# EAGLE design Upper_Board (EAGLE 7.2.0)
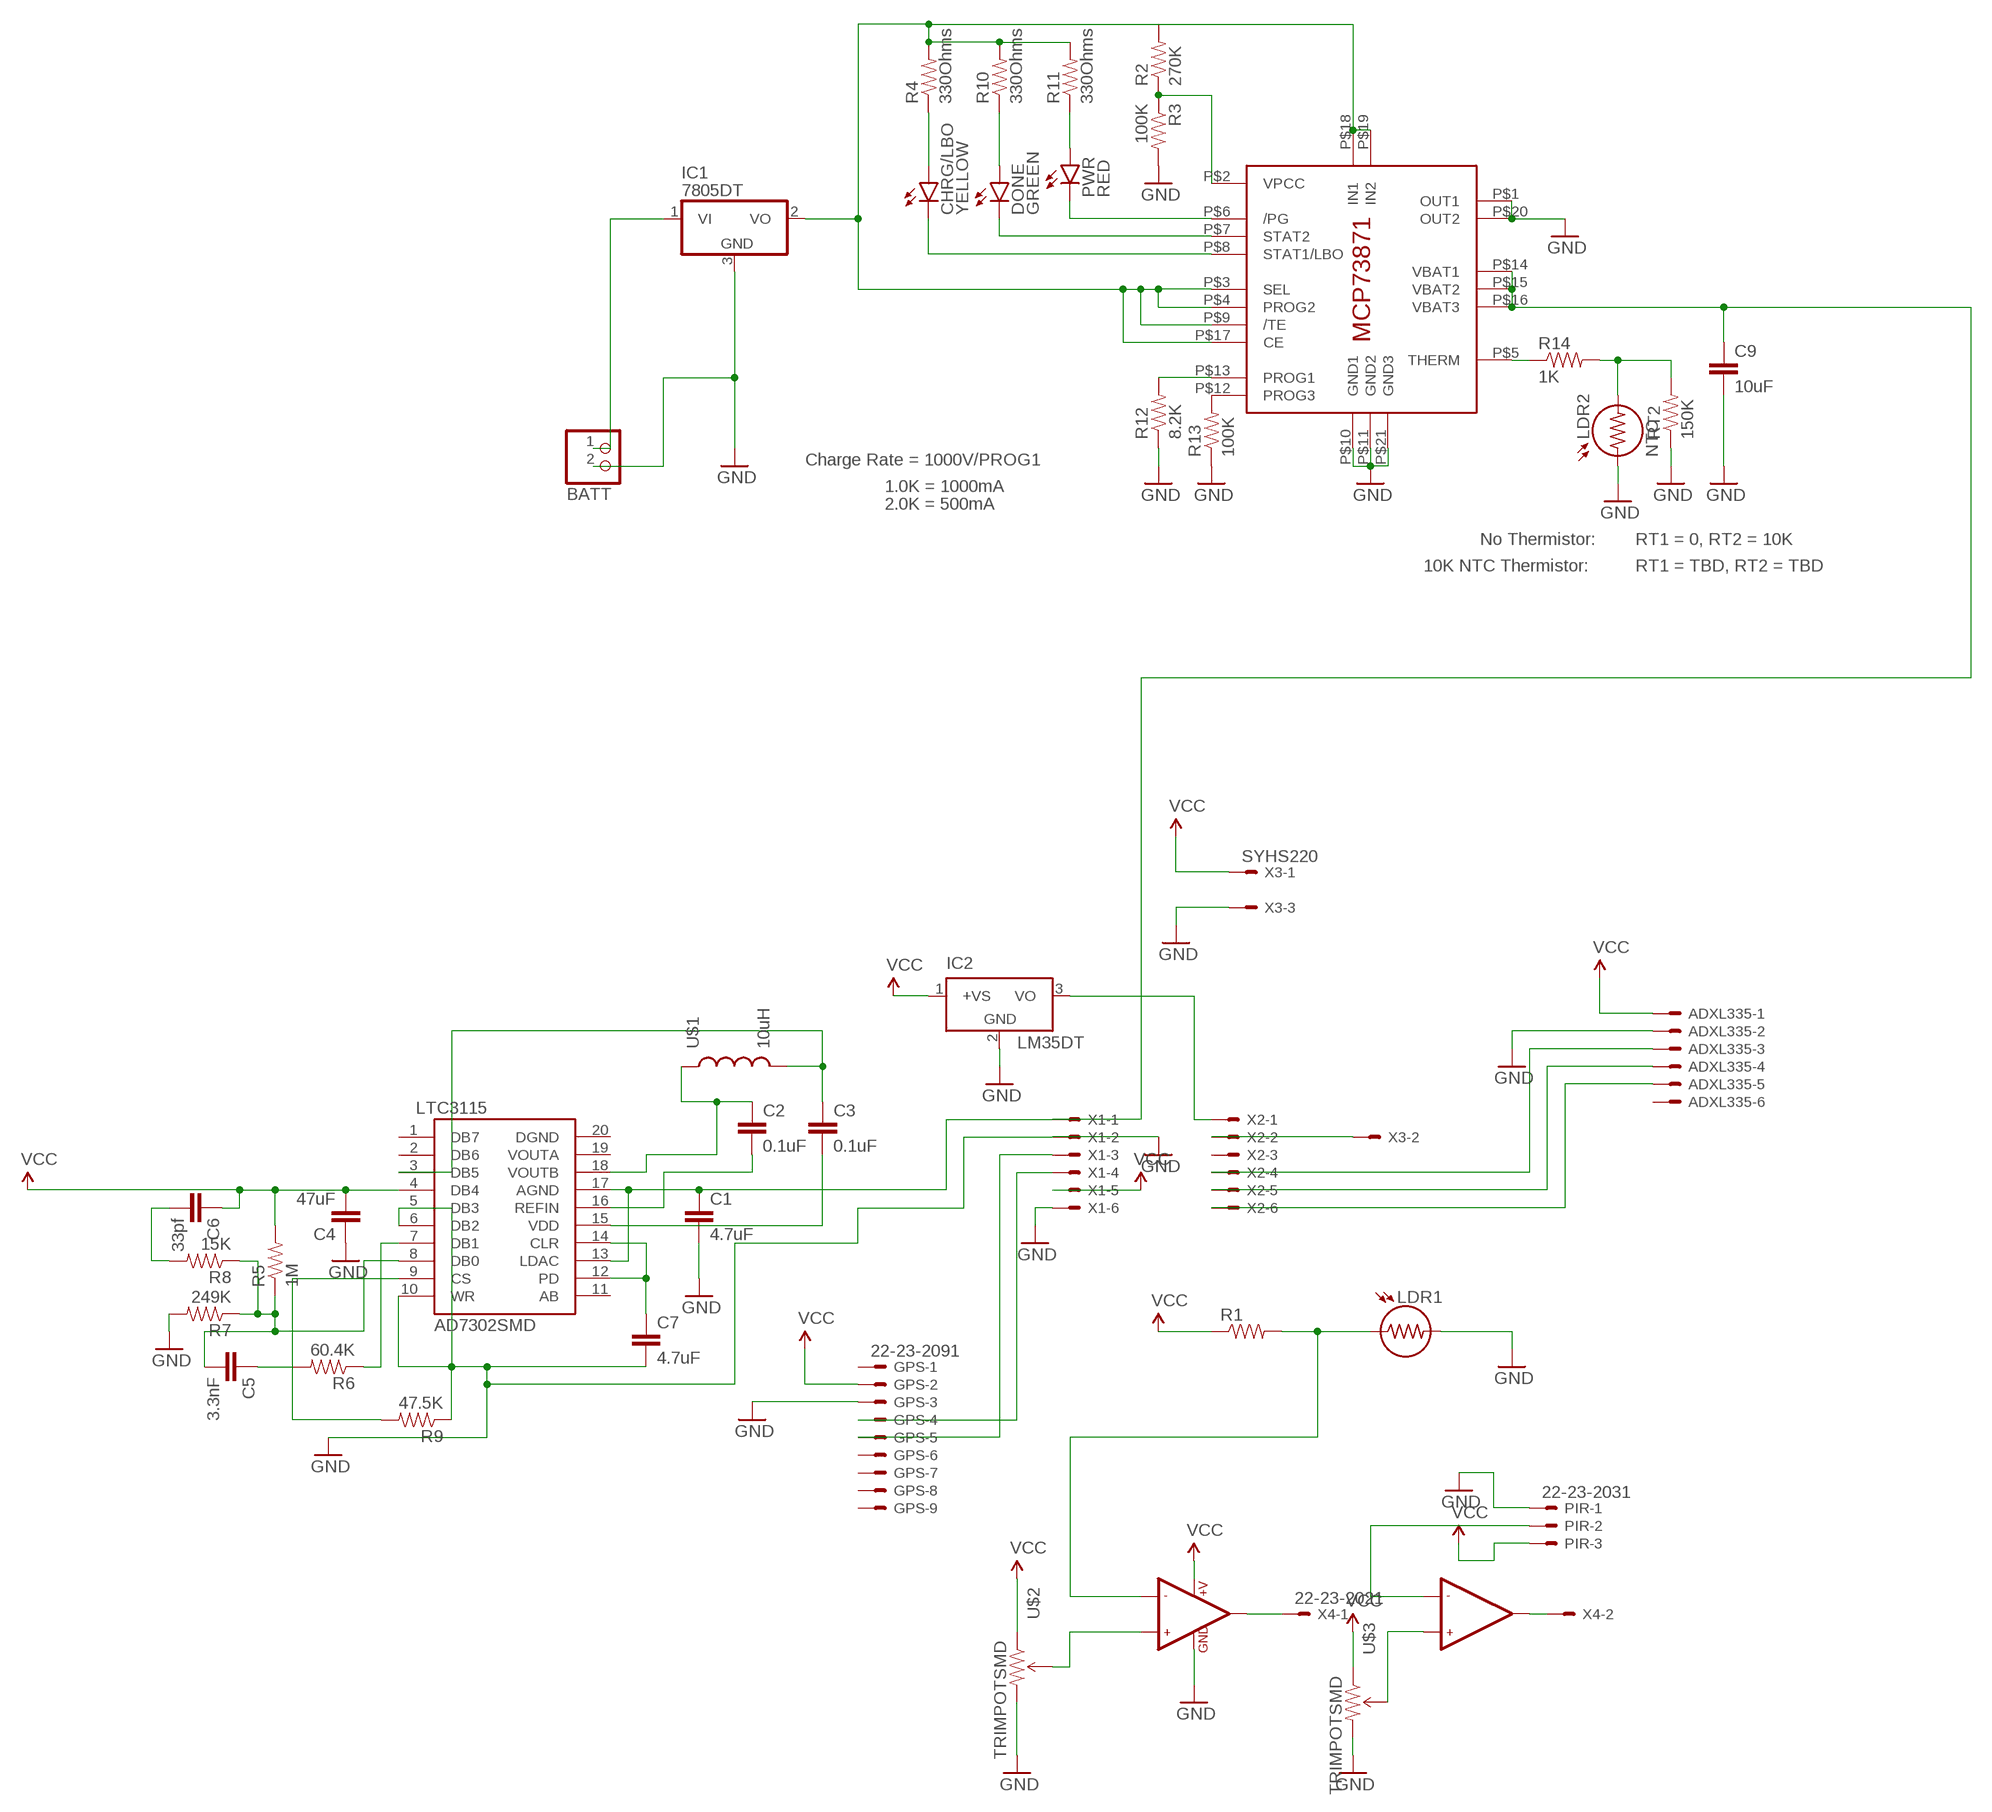
[diagram p0: schematic, sheet 1]

## Parts
ADXL335  22-23-2061  [22-23-2061]
BATT  JST_2PIN-SMT-RA  [JST-PH-2-SMT-RA]
C1  4.7uF  CAP0603-CAP  [0603-CAP]
C2  0.1uF  CAP0603-CAP  [0603-CAP]
C3  0.1uF  CAP0603-CAP  [0603-CAP]
C4  47uF  CAP0603-CAP  [0603-CAP]
C5  3.3nF  CAP0603-CAP  [0603-CAP]
C6  33pf  CAP0603-CAP  [0603-CAP]
C7  4.7uF  CAP0603-CAP  [0603-CAP]
C9  10uF  CAP0603-CAP  [0603-CAP]
CHRG/LBO  YELLOW  LED-YELLOWLARGE  [LED-1206]
DONE  GREEN  LED-GREENLARGE  [LED-1206]
GPS  22-23-2091  [22-23-2091]
IC1  7805DT  [TO252]
IC2  LM35DT  [TO220V]
IC4  MCP73871  [QFN20_4MM]
LDR1  LDR5MM  [LDR338-54C]
LDR2  NTC  LDR5MM  [LDR338-54C]
LTC3115  AD7302SMD  [TSSOP20]
PIR  22-23-2031  [22-23-2031]
PWR  RED  LED-RED1206  [LED-1206]
R1  RESISTOR1206  [1206]
R2  270K  RESISTOR1206  [1206]
R3  100K  RESISTOR1206  [1206]
R4  330Ohms  RESISTOR1206  [1206]
R5  1M  RESISTOR1206  [1206]
R6  60.4K  RESISTOR1206  [1206]
R7  249K  RESISTOR1206  [1206]
R8  15K  RESISTOR1206  [1206]
R9  47.5K  RESISTOR1206  [1206]
R10  330Ohms  RESISTOR1206  [1206]
R11  330Ohms  RESISTOR1206  [1206]
R12  8.2K  RESISTOR1206  [1206]
R13  100K  RESISTOR1206  [1206]
R14  1K  RESISTOR1206  [1206]
RT2  150K  RESISTOR1206  [1206]
U$1  10uH  INDUCTOR1206H*  [INDUCTOR-1206]
U$2  TRIMPOTSMD  [TRIMPOT-3MM]
U$3  TRIMPOTSMD  [TRIMPOT-3MM]
U$4  LMV358  [SO08]
X1  22-23-2061  [22-23-2061]
X2  22-23-2061  [22-23-2061]
X3  SYHS220  22-23-2031  [22-23-2031]
X4  22-23-2021  [22-23-2021]

## Nets
BATT: C1.1 C9.1 IC4.P$14(VBAT1) IC4.P$15(VBAT2) IC4.P$16(VBAT3) LTC3115.13(LDAC) LTC3115.17(AGND) X1.1
GND: ADXL335.2 BATT.2 C1.2 C4.1 C7.2 C9.2 GPS.3 IC1.3(GND) IC2.2(GND) IC4.P$1(OUT1) IC4.P$10(GND1) IC4.P$11(GND2) IC4.P$20(OUT2) IC4.P$21(GND3) LDR1.2 LDR2.1 LTC3115.5(DB3) LTC3115.6(DB2) LTC3115.10(WR) PIR.1 R3.2 R7.2 R9.1 R12.1 R13.1 RT2.1 U$2.3(CW) U$3.3(CW) U$4.4(GND) X1.2 X1.6 X3.3
N$1: LDR1.1 R1.2 U$4.2(-IN1)
N$2: IC2.3(VO) X2.1
N$3: U$4.1(OUT1) X4.1
N$4: U$4.7(OUT2) X4.2
N$5: U$2.2(WIPER) U$4.3(+IN1)
N$6: U$3.2(WIPER) U$4.5(+IN2)
N$7: X2.2 X3.2
N$8: IC4.P$2(VPCC) R2.1 R3.1
N$9: ADXL335.3 X2.4
N$10: PIR.2 U$4.6(-IN2)
N$11: ADXL335.4 X2.5
N$12: ADXL335.5 X2.6
N$13: IC4.P$6(/PG) PWR.C
N$14: DONE.C IC4.P$7(STAT2)
N$15: CHRG/LBO.C IC4.P$8(STAT1/LBO)
N$16: C2.2 LTC3115.16(REFIN)
N$17: C2.1 LTC3115.18(VOUTB) U$1.P$1
N$18: C3.1 LTC3115.3(DB5) U$1.P$2
N$19: C3.2 LTC3115.15(VDD)
N$20: CHRG/LBO.A R4.1
N$21: LTC3115.7(DB1) R6.1
N$22: C5.1 R6.2
N$23: C5.2 LTC3115.8(DB0) R5.1 R7.1 R8.1
N$24: DONE.A R10.1
N$25: C6.2 R8.2
N$26: PWR.A R11.1
N$27: C7.1 LTC3115.12(PD) LTC3115.14(CLR)
N$28: IC4.P$12(PROG3) R13.2
N$29: IC4.P$13(PROG1) R12.2
N$30: LTC3115.9(CS) R9.2
N$31: IC4.P$5(THERM) R14.1
N$32: LDR2.2 R14.2 RT2.2
N$33: IC1.2(VO) IC4.P$3(SEL) IC4.P$4(PROG2) IC4.P$9(/TE) IC4.P$17(CE) IC4.P$18(IN1) IC4.P$19(IN2) R2.2 R4.2 R10.2 R11.2
N$34: GPS.4 X1.4
N$35: GPS.5 X1.3
N$36: BATT.1 IC1.1(VI)
VCC: ADXL335.1 C4.2 C6.1 GPS.2 IC2.1(+VS) LTC3115.4(DB4) PIR.3 R1.1 R5.2 U$2.1(CCW) U$3.1(CCW) U$4.8(+V) X1.5 X3.1
Unconnected: ADXL335.6 GPS.1 GPS.6 GPS.7 GPS.8 GPS.9 LTC3115.1(DB7) LTC3115.2(DB6) LTC3115.11(AB) LTC3115.19(VOUTA) LTC3115.20(DGND) X2.3

## Notes on the sheet
- Charge Rate = 1000V/PROG1
- 1.0K = 1000mA
- 2.0K = 500mA
- No Thermistor: | RT1 = 0, RT2 = 10K
- 10K NTC Thermistor: | RT1 = TBD, RT2 = TBD

## Library data of the parts
ADXL335 X1 X2 = con-molex:22-23-2061: .100" (2.54mm) Center Header - 6 Pin; MF: MOLEX; MPN: 22-23-2061; OC_FARNELL: 1462922; OC_NEWARK: 27C1933
BATT = adafruit:JST_2PIN: JST 2-Pin Connectors of various flavors SMT-RA (S2B-PH-SM4) 4UConnector #17311 SMT (B2B-PH-SM4) THM-RA (S2B-PH) THM (B2B-PH)
C1-C7 C9 = SparkFun:CAP: Capacitor Standard 0603 ceramic capacitor, and 0.1" leaded capacitor.
CHRG/LBO = SparkFun-LED:LED-YELLOW: Yellow SMD LEDs LilyPad 1206- DIO-09909 0603- DIO-09003; PROD_ID: DIO-00820
DONE = SparkFun-LED:LED-GREEN: Various green LEDs Green LEDs used in SFE Production 0603- DIO-00821 LARGE- DIO-00862 LILYPAD- DIO-09910; PROD_ID: DIO-00862
GPS = con-molex:22-23-2091: .100" (2.54mm) Center Header - 9 Pin; MF: MOLEX; MPN: 22-23-2091; OC_FARNELL: 1756827; OC_NEWARK: 56H0450
IC1 = adafruit:78*: Positive VOLTAGE REGULATOR Added bigger pads to the TO-92 package
IC2 = lm35:LM35: Single-Supply Centigrade Temperature Sensor Vout = (10mV/°C x Temp °C) +5mmmV Source: http://www.national.com/ds/LM/LM35.pdf
IC4 = adafruit:MCP73871
LDR1 LDR2 = gm-resistors:LDR
LTC3115 = SparkFun-AnalogIC:AD7302: 8-bit parallel input 2-output DAC
PIR X3 = con-molex:22-23-2031: .100" (2.54mm) Center Header - 3 Pin; MF: MOLEX; MPN: 22-23-2031; OC_FARNELL: 1462950; OC_NEWARK: 30C0862
PWR = SparkFun-LED:LED-RED: Assorted Red LEDs LilyPad 1206- DIO-09912 1206- DIO-00809 0603- DIO-00819; PROD_ID: DIO-00809
R1-R14 RT2 = SparkFun:RESISTOR: Resistor Basic schematic elements and footprints for 0603, 1206, and PTH 1/10th watt (small) resistors.
U$1 = SparkFun:INDUCTOR: Inductors Basic Inductor/Choke - 0603 and 1206. Footprints are not proven and vary greatly between part numbers.
U$2 U$3 = SparkFun:TRIMPOT
U$4 = SparkFun:LMV358
X4 = con-molex:22-23-2021: .100" (2.54mm) Center Header - 2 Pin; MF: MOLEX; MPN: 22-23-2021; OC_FARNELL: 1462926; OC_NEWARK: 25C3832

## Board
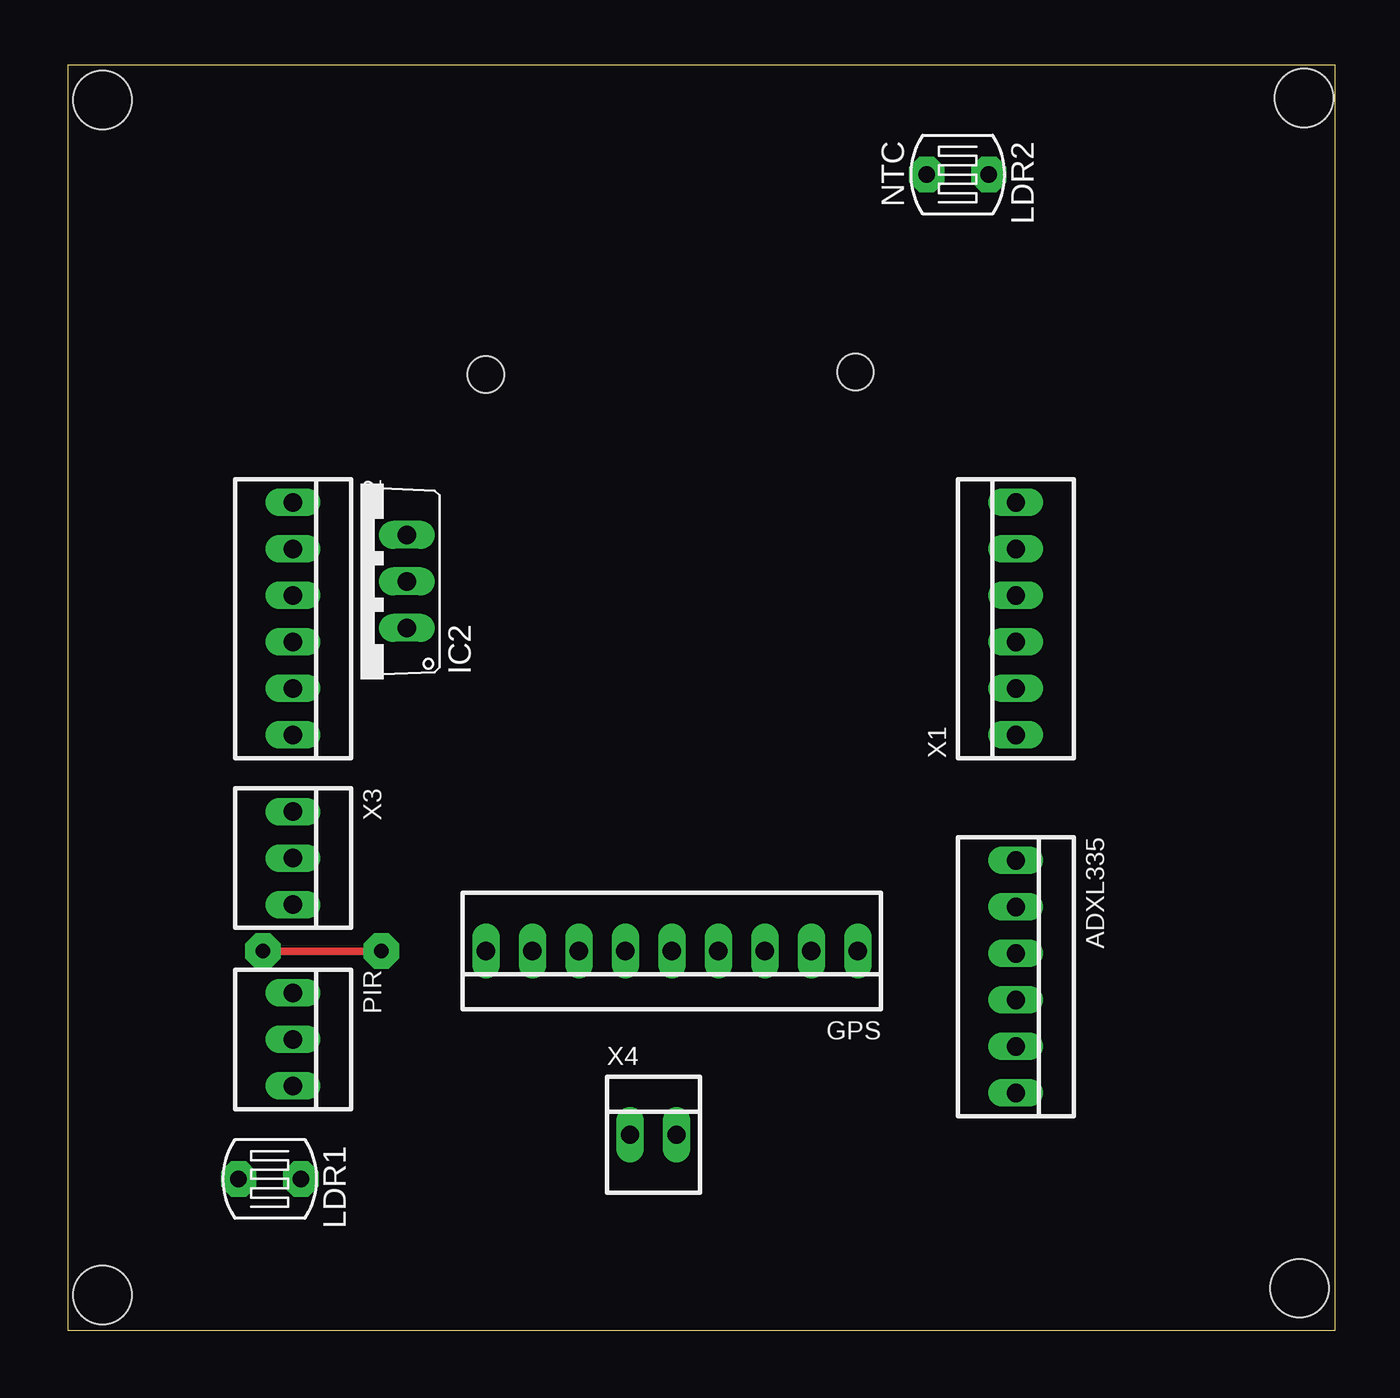
[diagram p1: board, top side]
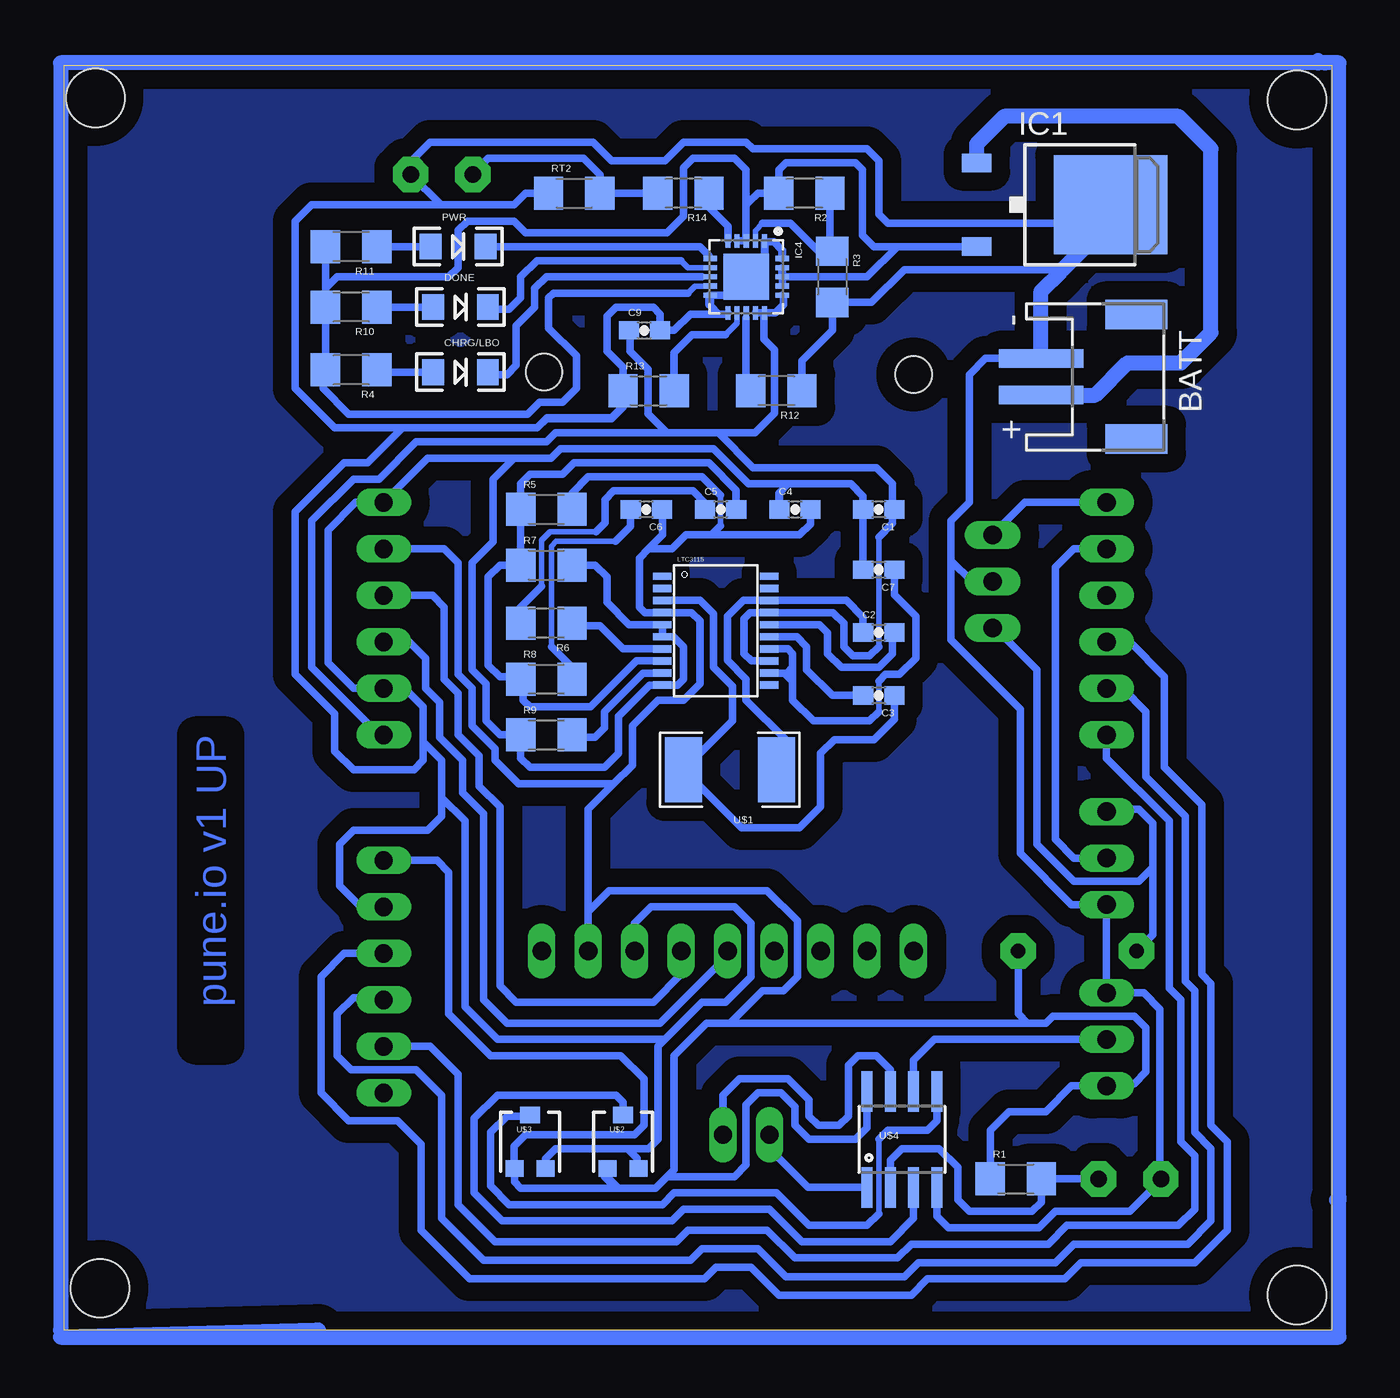
[diagram p2: board, bottom side, seen from below]

Size 69.27 x 69.08 mm. Coordinates in mm from the lower left corner, seen from the top.
Outline: 0,0 69.27,0 69.27,69.08 0,69.08 0,0
Copper layers (1*16): Top 0.035mm / dielectric 1.5mm / Bottom 0.035mm
Design rules "default": minimum track width 10mil, minimum drill 24mil, track to track 8mil, track to pad 8mil, pad to pad 8mil, via to via 8mil, smd to smd 8mil, copper to edge 40mil, drill to drill 8mil, minimum pad ring 10mil, minimum via ring 8mil, stop-mask expansion 4mil, vias tented up to drill 0mil, thermal gap 10mil
Holes 2 mm at 22.86,52.2 43.05,52.32
Holes 3.2 mm at 1.91,67.18 67.56,67.31 67.31,2.29 1.91,1.91

### Footprints (pad centres in the part's own frame; a part is rotated, then mirrored left to right if it is on the bottom)
22-23-2061 = drill 1 long: 1 -6.35,0; 2 -3.81,0; 3 -1.27,0; 4 1.27,0; 5 3.81,0; 6 6.35,0
JST-PH-2-SMT-RA = smd 1 x 4.6: 1 1,-3.7; 2 -1,-3.7 | smd 1.6 x 3.4: NC1 -3.4,1.5; NC2 3.4,1.5
0603-CAP = smd 1.1 x 1: 1 -0.85,0; 2 0.85,0
LED-1206 = smd 1.2 x 1.4: A -1.5,0; C 1.5,0
22-23-2091 = drill 1 long: 1 -10.16,0; 2 -7.62,0; 3 -5.08,0; 4 -2.54,0; 5 0,0; 6 2.54,0; 7 5.08,0; 8 7.62,0; 9 10.16,0
TO252 = smd 1 x 1.6: 1 -2.28,-4.8; 2 2.28,-4.8 | smd 5.4 x 6.2: 3 0,2.5
TO220V = drill 1.016 long: 1 -2.54,-2.54; 2 0,-2.54; 3 2.54,-2.54
QFN20_4MM = smd 0.73 x 0.28: P$1 -1.965,1; P$2 -1.965,0.5; P$3 -1.965,0; P$4 -1.965,-0.5; P$5 -1.965,-1; P$11 1.965,-1; P$12 1.965,-0.5; P$13 1.965,0; P$14 1.965,0.5; P$15 1.965,1 | smd 0.28 x 0.73: P$6 -1,-1.965; P$7 -0.5,-1.965; P$8 0,-1.965; P$9 0.5,-1.965; P$10 1,-1.965; P$16 1,1.965; P$17 0.5,1.965; P$18 0,1.965; P$19 -0.5,1.965; P$20 -1,1.965 | smd 2.5 x 2.5: P$21 0,0
LDR338-54C = drill 0.9 pad 1.93 octagon: 1 0,1.702; 2 0,-1.702
TSSOP20 = smd 1 x 0.4: 1 -2.937,2.693; 2 -2.937,2.032; 3 -2.937,1.372; 4 -2.937,0.712; 5 -2.937,0.051; 6 -2.937,-0.609; 7 -2.937,-1.27; 8 -2.943,-1.93; 9 -2.937,-2.59; 10 -2.937,-3.251; 11 2.905,-3.251; 12 2.905,-2.59; 13 2.911,-1.93; 14 2.905,-1.27; 15 2.905,-0.609; 16 2.905,0.051; 17 2.905,0.712; 18 2.905,1.372; 19 2.905,2.032; 20 2.905,2.693
22-23-2031 = drill 1 long: 1 -2.54,0; 2 0,0; 3 2.54,0
1206 = smd 1.6 x 1.8: 1 -1.4,0; 2 1.4,0
INDUCTOR-1206 = smd 2.032 x 3.556: P$1 -2.54,0; P$2 2.54,0
TRIMPOT-3MM = smd 1 x 0.9: 1 -0.85,-1.45; 3 0.85,-1.45 | smd 1.1 x 0.9: 2 0,1.45
SO08 = smd 0.61 x 2.21: 1 -1.905,-2.616; 2 -0.635,-2.616; 3 0.635,-2.616; 4 1.905,-2.616; 5 1.905,2.616; 6 0.635,2.616; 7 -0.635,2.616; 8 -1.905,2.616
22-23-2021 = drill 1 long: 1 -1.27,0; 2 1.27,0

### Placement (x,y rotation side)
ADXL335  51.82,19.3 270 top
BATT  12.19,52.07 270 bottom
C1  24.77,44.83 180 bottom
C2  24.77,38.1 0 bottom
C3  24.77,34.67 180 bottom
C4  29.34,44.83 0 bottom
C5  33.4,44.83 0 bottom
C6  37.47,44.83 180 bottom
C7  24.77,41.53 180 bottom
C9  37.57,54.61 0 bottom
CHRG/LBO  47.62,52.32 0 bottom
DONE  47.62,55.88 0 bottom
GPS  33.02,20.7 180 top
IC1  14.61,61.47 270 bottom
IC2  16,40.89 90 top
IC4  32,57.53 270 bottom
LDR1  11.05,8.26 270 top
LDR2  48.64,63.12 270 top
LTC3115  33.66,38.48 0 bottom
PIR  12.32,15.88 270 top
PWR  47.75,59.18 0 bottom
R1  17.27,8.26 0 bottom
R2  28.83,62.1 180 bottom
R3  27.3,57.53 270 bottom
R4  53.59,52.45 180 bottom
R5  42.93,44.83 0 bottom
R6  42.93,38.61 180 bottom
R7  42.93,41.78 0 bottom
R8  42.93,35.56 0 bottom
R9  42.93,32.51 0 bottom
R10  53.59,55.88 180 bottom
R11  53.59,59.18 180 bottom
R12  30.35,51.31 180 bottom
R13  37.34,51.31 0 bottom
R14  35.43,62.1 180 bottom
RT2  41.4,62.1 0 bottom
U$1  32.89,30.61 180 bottom
U$2  38.73,10.29 0 bottom
U$3  43.81,10.29 0 bottom
U$4  23.5,10.41 0 bottom
X1  51.82,38.86 90 top
X2  12.32,38.86 270 top
X3  12.32,25.78 270 top
X4  32,10.67 0 top

### Tracks (layer width: path | path; a pad name or v marks a point on that pad's centre or on a via)
BATT
  Bottom 0.305: 24.77,37.34 24.77,43.31
  Bottom 0.406: LTC3115.13 31.73,36.55 32.13,36.96 32.13,38.86 31.8,39.19 LTC3115.17 27.25,39.19 26.67,38.61 26.67,37.34 26.16,36.83 25.27,36.83 24.77,37.34 | 24.77,43.31 24,44.07 24,44.74 C1.1 24,44.92 24,46.23 24.89,47.12 31.62,47.12 33.53,49.02 | X1.1 52.07,32.51 55.75,36.2 55.75,44.2 53.47,46.48 52.07,46.48 50.04,48.51 42.93,48.51 42.42,49.02 36.32,49.02 | 36.32,49.02 33.53,49.02 | IC4.P$16 29.97,56.46 29.97,56.01 30.41,55.57 IC4.P$15 IC4.P$14 31.08,55.57 31.04,55.52 31.04,54.13 30.45,53.54 30.45,50.09 31.52,49.02 33.53,49.02 | 36.32,49.02 37.36,50.06 37.36,52.48 38.35,53.47 38.35,54.55 C9.1
GND
  Bottom 0.406: C7.2 C1.2 25.61,45.55 26.29,46.23 29.72,46.23 | 30.23,45.72 30.23,44.87 C4.1 30.19,45.68 30.23,45.72 | R7.2 40.26,41.78 39.62,41.15 39.62,39.75 38.41,38.53 LTC3115.5 LTC3115.6 35.97,37.87 35.43,37.34 35.43,35.56 35.76,35.23 LTC3115.10 37.29,35.23 38.99,33.53 38.99,31.5 39.75,30.73 43.81,30.73 44.32,31.24 R9.1 45.47,32.51 46.23,33.27 46.23,35.31 46.99,36.07 46.99,41.91 45.85,43.05 45.85,46.48 44.7,47.62 | 30.23,45.72 29.72,46.23 | 29.72,46.23 31.88,46.23 33.78,48.13 42.16,48.13 42.67,47.62 44.7,47.62 | 44.7,47.62 49.4,47.62 X1.6 53.34,45.21 54.86,43.69 54.86,36.45 53.47,35.05 X1.2 50.67,35.05 49.66,34.04 49.66,32.13 | GPS.3 38.1,22.23 37.21,23.11 32.64,23.11 31.75,22.23 31.75,19.3 33.15,17.91 34.42,17.91 36.45,15.88 | 36.45,15.88 36.83,15.49 36.83,10.41 37.34,9.91 38.48,9.91 | 14.86,57.91 23.37,57.91 25.15,56.13 R3.2 27.3,54.61 28.96,52.96 R12.1 | 14.86,57.91 14.8,57.85 | 30.94,59.44 30.48,59.44 30.04,58.99 IC4.P$20 | 33.97,55.94 IC4.P$10 33,56.53 IC4.P$21 31.24,58.29 31.11,58.29 31,58.4 IC4.P$1 30.94,59.44 | 33.53,55.5 33.07,55.5 IC4.P$11 | 38.74,52.58 R13.1 38.74,50.47 39.37,49.84 42.9,49.84 43.43,49.3 50.77,49.3 52.7,47.37 53.98,47.37 56.64,44.7 56.64,35.81 54.48,33.66 54.48,31.62 53.47,30.61 50.16,30.61 49.66,31.11 49.66,32.13 | 36.7,54.62 36.7,55.5 37.08,55.88 39.12,55.88 39.62,55.37 39.62,53.47 38.74,52.58 | 36.7,54.62 C9.2 36.7,54.61 | 38.74,52.58 38.73,52.58 38.73,50.42 39.37,49.78 42.93,49.78 43.43,49.28 54.48,49.28 56.64,51.44 56.64,60.58 55.75,61.47 48.69,61.47 | 50.22,63.04 50.42,63.04 LDR2.1 | 14.86,57.91 14.73,57.91 14.73,58.04 12.83,59.94 13.84,59.94 14.35,60.45 24.26,60.45 24.77,60.96 24.77,63.88 25.4,64.52 31.62,64.52 32,64.9 35.43,64.9 36.45,63.88 39.37,63.88 40.39,64.9 49.28,64.9 50.29,63.88 50.29,63.17 LDR2.1
  Bottom 0.406: RT2.1 44.07,62.1 44.7,61.47 48.69,61.47 | 48.69,61.47 LDR2.1 | 30.94,59.44 30.99,59.44 30.99,58.29 31.5,57.78 31.62,57.78 32.89,56.52 34.04,56.52 34.04,56.01 33.97,55.94 | 33.97,55.94 33.53,55.5 | 33.53,55.5 35.05,55.5 35.94,54.61 36.7,54.61 | 36.7,54.61 36.7,54.62 | U$3.3 42.97,9.36 42.42,9.91 38.48,9.91 | 38.48,9.91 37.97,9.4 37.97,8.93 U$2.3 | 20.83,42.04 20.83,44.2 19.81,45.21 19.81,52.2 18.92,53.09 15.91,53.09 BATT.2 | IC2.2 19.68,40.89 20.83,42.04 | 20.83,42.04 20.83,37.72 17.02,33.91 17.02,26.04 14.22,23.24 X3.3 PIR.1 10.29,18.41 9.4,17.53 9.4,8.31 LDR1.2 9.35,8.18 11.05,6.48 15.11,6.48 16,5.59 20.95,5.59 21.59,6.22 U$4.4 | 36.45,15.88 45.59,15.88 47.37,17.65 47.37,27.81 48.64,29.08 | 48.64,29.08 48.64,31.11 49.66,32.13 | ADXL335.2 53.09,23.11 54.23,24.26 54.23,26.54 53.47,27.3 49.4,27.3 48.64,28.07 48.64,29.08
  Bottom 0.813: BATT.2 15.89,56.75 14.8,57.85 14.73,57.91 11.81,60.83 11.81,61.17 IC1.3
N$1
  Bottom 0.406: LDR1.1 R1.2 15.87,6.99 16.38,6.48 19.81,6.48 20.45,7.11 20.45,8.89 21.46,9.91 23.5,9.91 24.13,9.27 U$4.2
N$2
  Bottom 0.406: X2.1 16.76,45.21 IC2.3
N$3
  Bottom 0.406: U$4.1 28.63,7.8 30.73,9.91 X4.1
N$4
  Bottom 0.406: X4.2 33.27,12.83 32.38,13.72 29.72,13.72 28.57,12.57 28.57,11.68 28.07,11.18 26.92,11.18 26.42,11.68 26.42,14.48 25.91,14.99 24.89,14.99 24.13,14.22 U$4.7
N$5
  Bottom 0.406: U$4.3 22.86,6.1 24.13,4.83 28.96,4.83 30.73,6.6 35.43,6.6 36.07,5.97 45.34,5.97 46.86,7.49 46.86,11.56 45.59,12.83 39.12,12.83 38.73,12.45 U$2.2
N$6
  Bottom 0.305: 24.77,10.41 24.77,6.35
  Bottom 0.406: U$4.5 21.59,11.43 22.1,10.92 24.26,10.92 24.77,10.41 | 24.77,6.35 25.4,5.71 28.57,5.71 30.35,7.49 35.94,7.49 36.58,6.86 44.96,6.86 45.97,7.87 45.97,10.79 45.09,11.68 43.87,11.68 U$3.2
N$7
  Bottom 0.406: X2.2 14.1,42.67 15.11,41.66 15.11,26.8 14.1,25.78 X3.2
N$8
  Bottom 0.305: IC4.P$2 31.5,60.06 31.11,60.45
  Bottom 0.406: R2.1 27.43,59.05 R3.1 28.07,58.93 29.59,60.45 31.11,60.45
N$9
  Bottom 0.406: X2.4 11.05,37.59 9.14,35.69 9.14,30.73 7.11,28.7 7.11,19.43 6.6,18.92 6.6,11.18 5.71,10.29 5.71,5.46 7.49,3.68 13.72,3.68 14.61,2.79 22.1,2.79 22.99,1.91 30.23,1.91 31.75,3.43 33.66,3.43 34.29,2.79 47.12,2.79 49.78,5.46 49.78,10.16 51.05,11.43 53.72,11.43 55.24,12.95 55.24,19.3 53.98,20.57 ADXL335.3
N$10
  Bottom 0.406: PIR.2 21.72,15.88 22.86,14.73 U$4.6
N$11
  Bottom 0.406: X2.5 11.43,35.05 10.16,33.78 10.16,30.23 8,28.07 8,19.05 7.49,18.54 7.49,10.79 6.6,9.91 6.6,5.97 7.87,4.7 14.1,4.7 15.11,3.68 22.61,3.68 23.37,2.92 29.84,2.92 31.37,4.45 34.42,4.45 35.05,3.81 46.35,3.81 48.64,6.1 48.64,12.83 50.04,14.22 53.59,14.22 54.36,14.99 54.36,17.27 53.47,18.16 51.94,18.16 ADXL335.4
N$12
  Bottom 0.406: X2.6 12.32,31.24 8.89,27.81 8.89,18.67 8.26,18.03 8.26,10.29 7.49,9.53 7.49,6.6 8.38,5.71 14.48,5.71 15.49,4.7 22.99,4.7 23.75,3.94 29.34,3.94 30.86,5.46 35.18,5.46 35.81,4.83 45.72,4.83 47.75,6.86 47.75,13.97 49.28,15.49 ADXL335.5
N$13
  Bottom 0.254: IC4.P$6 33.97,58.61 34.04,58.67
  Bottom 0.406: 34.04,58.67 34.54,59.18 PWR.C
N$14
  Bottom 0.254: IC4.P$7 35.17,58.03 35.18,58.04
  Bottom 0.305: 34.42,58.04 35.18,58.04 35.56,58.42
  Bottom 0.406: 35.56,58.42 43.43,58.42 44.32,57.53 44.32,56.39 44.96,55.75 46,55.75 DONE.C
N$15
  Bottom 0.254: IC4.P$8 34.42,57.53
  Bottom 0.406: 34.42,57.53 42.93,57.53 43.56,56.9 43.56,55.88 44.58,54.86 44.58,52.7 45.09,52.2 46,52.2 CHRG/LBO.C
N$16
  Bottom 0.406: LTC3115.16 27.99,38.53 27.56,38.1 27.56,36.96 26.8,36.2 24.77,36.2 24,36.96 24,38.01 C2.2
N$17
  Bottom 0.406: C2.1 25.61,38.95 26.52,39.85 LTC3115.18 32.16,39.85 33.02,38.99 33.02,36.58 32,35.56 32,34.42 29.84,32.26 29.84,31.11 U$1.P$1
N$18
  Bottom 0.406: LTC3115.3 34.52,39.85 33.78,39.12 33.78,36.2 32.77,35.18 32.77,33.27 U$1.P$2 32.26,27.43 29.08,27.43 27.94,28.57 27.94,31.5 27.18,32.26 25.02,32.26 23.91,33.36 C3.1
N$19
  Bottom 0.406: C3.2 27.3,34.67 28.7,36.07 28.7,37.34 29.24,37.87 LTC3115.15
N$20
  Bottom 0.406: CHRG/LBO.A 52.07,52.32 R4.1
N$21
  Bottom 0.406: LTC3115.7 38.73,37.21 40.01,38.48 41.4,38.48 R6.1
N$22
  Bottom 0.305: 40.21,43.61 42.72,43.61 43.18,43.16 43.18,40.64
  Bottom 0.406: C5.1 34.25,45.17 34.92,45.85 39.24,45.85 39.73,45.36 39.73,44.09 40.21,43.61 | 43.18,40.64 44.55,39.27 44.55,38.83 R6.2
N$23
  Bottom 0.406: LTC3115.8 38,36.55 40.51,34.04 43.81,34.04 44.2,34.42 44.2,35.43 R8.1 44.45,35.69 45.47,35.69 46.1,36.32 46.1,41.15 45.47,41.78 R7.1 R5.1 44.32,46.23 43.81,46.74 42.04,46.74 41.4,47.37 34.04,47.37 32.55,45.89 C5.2
N$24
  Bottom 0.406: DONE.A R10.1
N$25
  Bottom 0.305: 39.14,43.08 42.39,43.08 42.65,42.82 42.65,37.34
  Bottom 0.406: C6.2 38.31,43.91 39.14,43.08 | 42.65,37.34 41.6,36.3 41.6,35.64 R8.2
N$26
  Bottom 0.406: PWR.A R11.1
N$27
  Bottom 0.305: 24.77,35.43 24.77,33.78
  Bottom 0.406: 29.77,35.89 29.46,36.2 | LTC3115.14 29.72,37.21 29.46,36.96 29.46,36.2 | C7.1 23.91,40.17 22.73,38.99 22.73,36.7 23.62,35.81 24.38,35.81 24.77,35.43 | 24.77,33.78 25.27,33.27 28.32,33.27 29.46,34.42 29.46,35.43 | 29.46,35.43 29.46,36.2 | LTC3115.12 29.92,35.89 29.46,35.43
N$28
  Bottom 0.305: IC4.P$12 32.5,55 33.15,54.36
  Bottom 0.406: 33.15,54.36 34.98,54.36 35.94,53.39 R13.2
N$29
  Bottom 0.254: IC4.P$13 32,55.3
  Bottom 0.406: 32,55.3 32,51.56 R12.2
N$30
  Bottom 0.406: LTC3115.9 37.64,35.89 39.75,33.78 39.75,32.89 40.26,32.38 41.4,32.38 R9.2
N$31
  Bottom 0.406: IC4.P$5 33,60.31 34.04,61.34 R14.1
N$32
  Bottom 0.406: LDR2.2 46.94,63.17 46.1,64.01 40.89,64.01 40.01,63.12 RT2.2 R14.2
N$33
  Bottom 0.254: IC4.P$19 IC4.P$18 IC4.P$17 | IC4.P$4 IC4.P$3 | IC4.P$9 34.79,57.03 34.8,57.02
  Bottom 0.305: 34.42,57.02 34.8,57.02 35.18,56.64
  Bottom 0.406: IC1.2 23.74,59.19 23.75,59.18 | 55.12,56.01 R10.2 | R10.2 R4.2 55.12,52.33 55.12,51.44 53.72,50.04 43.94,50.04 43.31,50.67 42.04,50.67 41.27,51.44 41.27,53.21 42.8,54.74 42.8,56.39 42.55,56.64 35.18,56.64 | R11.2 54.99,56.9 | 54.99,56.9 R10.2 | IC4.P$4 32.07,59.5 32,59.56 | 32,59.56 32,61.47 | 31.88,61.59 32,61.47 | 32,61.47 32,61.59 | 32,61.59 32,63.37 32.64,64.01 34.92,64.01 35.43,63.5 35.43,60.83 36.32,59.94 44.07,59.94 44.7,60.58 47.24,60.58 47.75,60.07 47.75,58.04 48.26,57.53 54.36,57.53 54.99,56.9 | IC4.P$3 32,59.56 | 32,61.59 31.88,61.59 | 31.88,61.59 31.37,62.1 R2.2 30.23,63.37 29.84,63.75 26.04,63.75 25.65,63.37 25.65,59.82 25.02,59.18 23.75,59.18 | 29.97,57.53 IC4.P$18 | IC4.P$19 30.04,57.6 29.97,57.53 | 29.97,57.53 25.4,57.53 23.75,59.18
N$34
  Bottom 0.406: GPS.4 35.56,19.43 37.08,17.91 44.58,17.91 45.47,18.8 45.47,28.57 46.61,29.72 46.61,31.37 47.75,32.51 47.75,34.8 48.51,35.56 48.51,39.5 49.15,40.13 X1.4
N$35
  Bottom 0.406: GPS.5 33.02,20.45 36.7,16.76 45.09,16.76 46.35,18.03 46.35,28.19 47.5,29.34 47.5,31.11 48.77,32.38 48.77,34.29 49.53,35.05 49.53,36.7 50.42,37.59 X1.3
N$36
  Bottom 0.813: BATT.1 12.94,51.07 11.18,52.83 8.26,52.83 6.6,54.48 6.6,64.52 8.38,66.29 17.91,66.29 19.41,64.8 IC1.1
N$37
  Bottom 0.813: 0.38,69.22 69.47,69.22 69.47,0
N$38
  Bottom 0.813: 55.37,0 55.5,0 69.47,-0.38 -0.38,-0.38 -0.38,7.24
N$39
  Bottom 0.813: -0.25,7.11 -0.38,7.11 -0.38,69.22 0.76,69.22 0.76,69.34
N$40
  pour Bottom (isolate 1.016): 0.51,68.33 68.45,68.33 68.45,0.51 0.51,0.51
VCC  (via drill 0.8 pad 1.93)
  Top 0.406: v17.14,20.7 v10.67,20.7
  Bottom 0.305: 33.4,43.94 33.4,45.59
  Bottom 0.406: C4.2 28.49,44.03 29.08,43.43 33.91,43.43 | 36.58,44.87 C6.1 36.58,44.79 36.58,43.43 37.34,42.67 | R5.2 41.53,45.72 40.64,46.61 34.42,46.61 33.4,45.59 | 37.34,42.67 37.85,42.16 37.85,39.5 37.54,39.19 LTC3115.4 35,39.19 34.54,38.73 34.54,35.31 35.43,34.42 36.83,34.42 38.23,33.02 38.23,30.86 39.24,29.84 | 33.4,43.94 33.91,43.43 | 33.91,43.43 35.31,43.43 36.07,42.67 37.34,42.67 | X1.5 48.51,42.67 47.75,41.91 47.75,35.81 46.99,35.05 46.99,33.02 45.72,31.75 45.72,31.11 44.45,29.84 39.24,29.84 | GPS.2 40.64,22.86 | 40.64,22.86 40.64,28.45 39.24,29.84 | 36.2,8.38 36.32,8.38 | 38.99,7.75 39.12,7.75 | 39.12,7.75 39.75,8.38 39.75,8.67 U$2.1 39.59,8.34 38.99,7.75 | 39.12,7.75 44.32,7.75 44.66,8.09 U$3.1 44.7,8.88 44.7,10.03 44.07,10.67 38.1,10.67 37.59,11.18 37.59,13.72 38.86,14.99 45.97,14.99 48.26,17.27 48.26,25.02 48.9,25.65 ADXL335.1 | 38.99,7.75 36.96,7.75 36.32,8.38 | 36.32,8.38 36.2,8.51 | 32.89,16.76 34.16,16.76 35.94,14.99 35.94,8.76 36.2,8.51 | 32.89,16.76 31.11,18.54 29.97,18.54 29.21,19.3 29.21,22.35 30.86,24 39.5,24 40.64,22.86 | U$4.8 25.4,11.05 26.04,10.41 28.57,10.41 29.34,11.18 29.34,12.19 30.1,12.95 31.37,12.95 32,12.32 32,9.02 32.64,8.38 36.2,8.38 | IC2.1 18.41,38.35 16.13,36.07 16.13,26.54 14.1,24.51 10.54,24.51 9.78,25.27 | 9.78,25.27 9.78,27.69 10.54,28.45 12.19,28.45 X3.1 | R1.1 18.67,10.92 17.65,11.94 15.62,11.94 14.22,13.34 PIR.3 12.19,13.46 10.79,13.46 10.16,14.1 10.16,16.51 10.79,17.14 15.24,17.14 15.62,16.76 16.64,16.76 | 36.2,8.38 36.2,8.51 | 32.89,16.76 16.64,16.76 | 9.78,25.27 9.78,21.59 v10.67,20.7 | 16.64,16.76 17.14,17.27 v17.14,20.7
(copper drawn outside any net)
  shapes: Bottom area x3

### Text on the board
Bottom: pune.io v1 UP